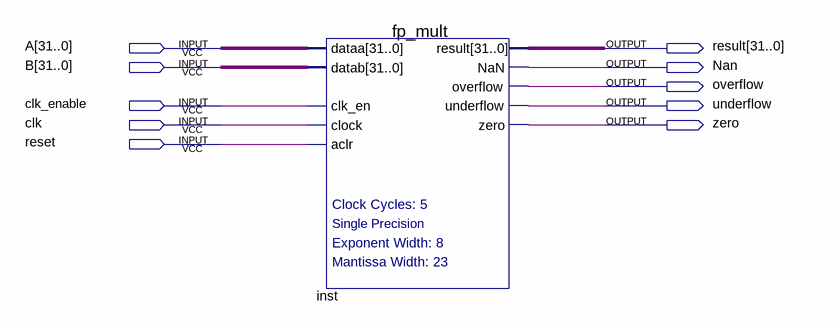
[diagram p0: schematic sheet]
// Quartus schematic fp_mult.bdf as structural Verilog: 1 symbols, 10 pins
module fp_mult (
  input  [31:0] A,
  input  [31:0] B,
  input  clk_enable,
  input  clk,
  input  reset,
  output [31:0] result,
  output Nan,
  output overflow,
  output underflow,
  output zero
);

  fp_mult inst (
    .dataa(A), .datab(B), .clk_en(clk_enable), .clock(clk), .aclr(reset), .result(result), .NaN(Nan),
    .overflow(overflow), .underflow(underflow), .zero(zero));
endmodule
